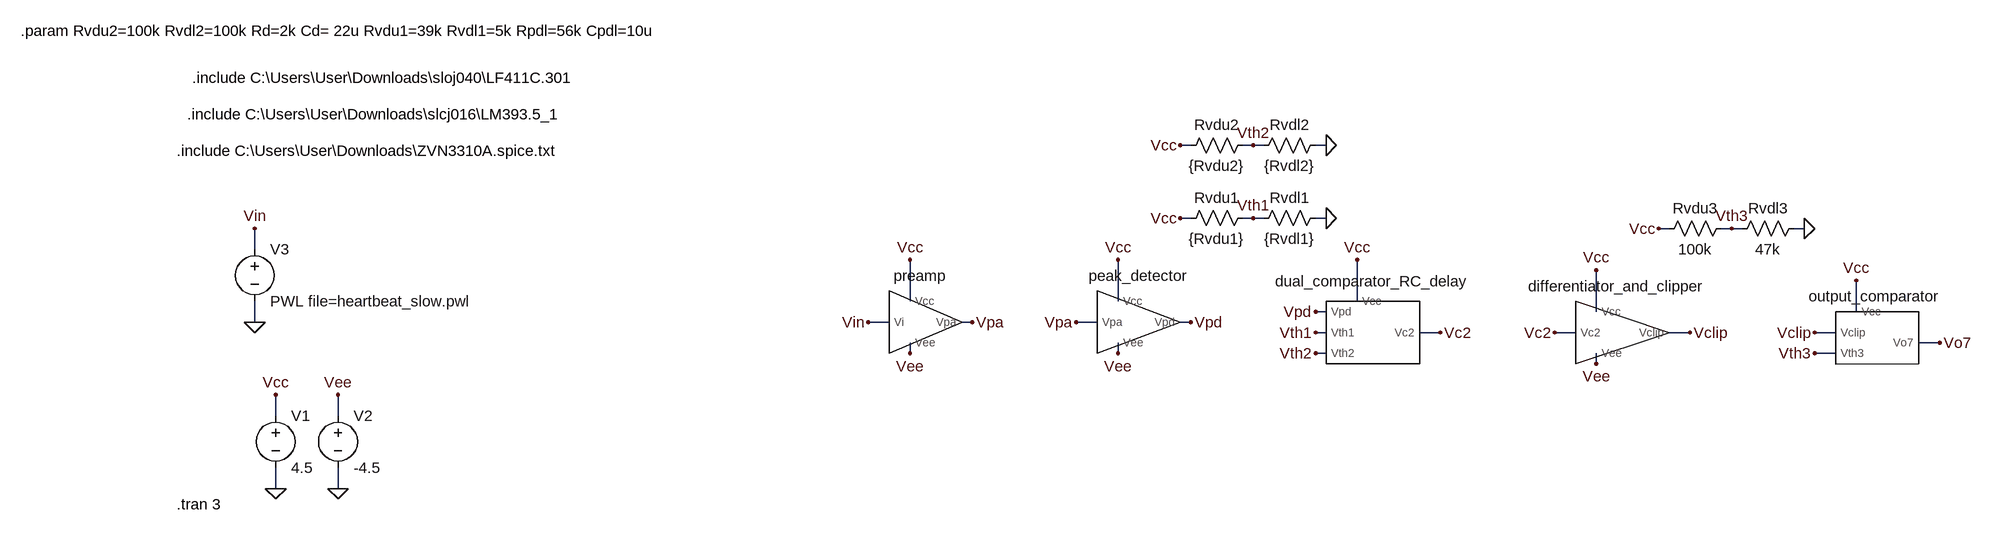
[diagram p0: schematic comparator_delay_demo.asc]
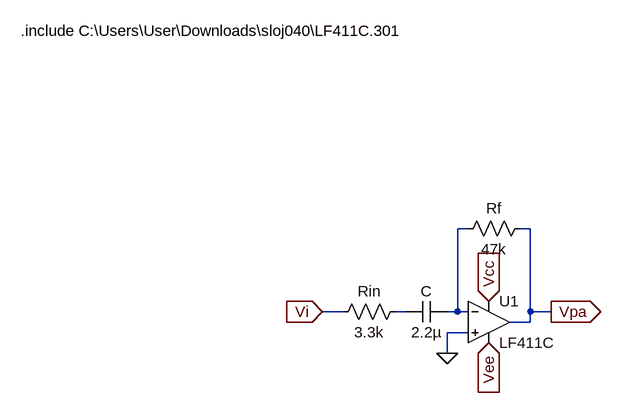
[diagram p1: sub-circuit preamp.asc]
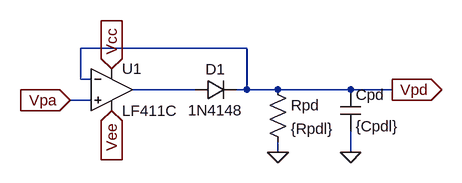
[diagram p2: sub-circuit peakdetector_lab7.asc]
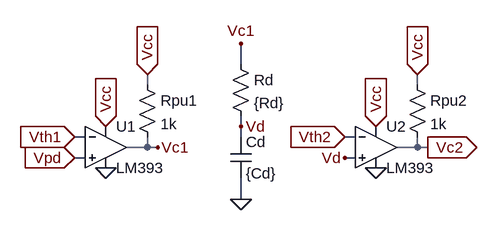
[diagram p3: sub-circuit delay.asc]
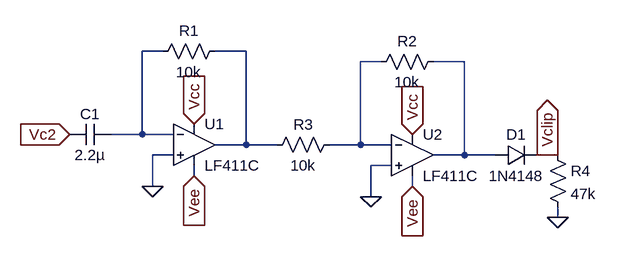
[diagram p4: sub-circuit differentiator_clipper.asc]
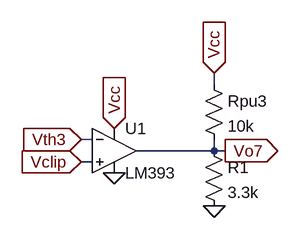
[diagram p5: sub-circuit outputcomparator.asc]
comparator_delay_demo.asc, the LTspice schematic file:
Version 4
SHEET 1 3844 680
WIRE 1344 -368 1328 -368
WIRE 1440 -368 1424 -368
WIRE 1456 -368 1440 -368
WIRE 1552 -368 1536 -368
WIRE 1344 -256 1328 -256
WIRE 1440 -256 1424 -256
WIRE 1456 -256 1440 -256
WIRE 1552 -256 1536 -256
WIRE 2080 -240 2064 -240
WIRE 2176 -240 2160 -240
WIRE 2192 -240 2176 -240
WIRE 2288 -240 2272 -240
WIRE -96 -208 -96 -240
WIRE 912 -128 912 -192
WIRE 1232 -128 1232 -192
WIRE 1600 -128 1600 -192
WIRE 1552 -112 1536 -112
WIRE 1968 -112 1968 -176
WIRE 2368 -112 2368 -160
WIRE -96 -96 -96 -128
WIRE 880 -96 848 -96
WIRE 1008 -96 992 -96
WIRE 1200 -96 1168 -96
WIRE 1344 -96 1328 -96
WIRE 1552 -80 1536 -80
WIRE 1728 -80 1696 -80
WIRE 1936 -80 1904 -80
WIRE 2112 -80 2080 -80
WIRE 2336 -80 2304 -80
WIRE 2496 -64 2464 -64
WIRE 912 -48 912 -64
WIRE 1232 -48 1232 -64
WIRE 1552 -48 1536 -48
WIRE 2336 -48 2304 -48
WIRE 1968 -32 1968 -48
WIRE -64 48 -64 16
WIRE 32 48 32 16
WIRE -64 160 -64 128
WIRE 32 160 32 128
FLAG -64 160 0
FLAG 32 160 0
FLAG -64 16 Vcc
FLAG 32 16 Vee
FLAG -96 -96 0
FLAG -96 -240 Vin
FLAG 1552 -256 0
FLAG 1328 -256 Vcc
FLAG 1440 -256 Vth1
FLAG 1552 -368 0
FLAG 1328 -368 Vcc
FLAG 1440 -368 Vth2
FLAG 912 -48 Vee
FLAG 1008 -96 Vpa
FLAG 848 -96 Vin
FLAG 2288 -240 0
FLAG 2064 -240 Vcc
FLAG 2176 -240 Vth3
FLAG 1232 -48 Vee
FLAG 1168 -96 Vpa
FLAG 912 -192 Vcc
FLAG 1232 -192 Vcc
FLAG 1344 -96 Vpd
FLAG 1536 -112 Vpd
FLAG 1536 -80 Vth1
FLAG 1536 -48 Vth2
FLAG 1600 -192 Vcc
FLAG 1728 -80 Vc2
FLAG 1904 -80 Vc2
FLAG 1968 -176 Vcc
FLAG 1968 -32 Vee
FLAG 2112 -80 Vclip
FLAG 2304 -80 Vclip
FLAG 2304 -48 Vth3
FLAG 2368 -160 Vcc
FLAG 2496 -64 Vo7
SYMBOL voltage -64 32 R0
WINDOW 123 0 0 Left 0
WINDOW 39 0 0 Left 0
SYMATTR InstName V1
SYMATTR Value 4.5
SYMBOL voltage 32 32 R0
WINDOW 123 0 0 Left 0
WINDOW 39 0 0 Left 0
SYMATTR InstName V2
SYMATTR Value -4.5
SYMBOL voltage -96 -224 R0
WINDOW 123 0 0 Left 0
WINDOW 39 0 0 Left 0
SYMATTR InstName V3
SYMATTR Value PWL file=heartbeat_slow.pwl
SYMBOL res 1440 -240 R270
WINDOW 0 32 56 VTop 2
WINDOW 3 0 56 VBottom 2
SYMATTR InstName Rvdl1
SYMATTR Value {Rvdl1}
SYMBOL res 1328 -240 R270
WINDOW 0 32 56 VTop 2
WINDOW 3 0 56 VBottom 2
SYMATTR InstName Rvdu1
SYMATTR Value {Rvdu1}
SYMBOL res 1440 -352 R270
WINDOW 0 32 56 VTop 2
WINDOW 3 0 56 VBottom 2
SYMATTR InstName Rvdl2
SYMATTR Value {Rvdl2}
SYMBOL res 1328 -352 R270
WINDOW 0 32 56 VTop 2
WINDOW 3 0 56 VBottom 2
SYMATTR InstName Rvdu2
SYMATTR Value {Rvdu2}
SYMBOL preamp 928 -96 R0
SYMATTR InstName preamp
SYMBOL res 2176 -224 R270
WINDOW 0 32 56 VTop 2
WINDOW 3 0 56 VBottom 2
SYMATTR InstName Rvdl3
SYMATTR Value 47k
SYMBOL res 2064 -224 R270
WINDOW 0 32 56 VTop 2
WINDOW 3 0 56 VBottom 2
SYMATTR InstName Rvdu3
SYMATTR Value 100k
SYMBOL peakdetector_lab7 1264 -96 R0
SYMATTR InstName peak_detector
SYMBOL delay 1616 -96 R0
SYMATTR InstName dual_comparator_RC_delay
SYMBOL differentiator_clipper 2000 -80 R0
SYMATTR InstName differentiator_and_clipper
SYMBOL outputcomparator 2384 -64 R0
SYMATTR InstName output_comparator
TEXT -216 -360 Left 2 !.include C:\\Users\\User\\Downloads\\ZVN3310A.spice.txt
TEXT -200 -416 Left 2 !.include C:\\Users\\User\\Downloads\\slcj016\\LM393.5_1
TEXT -456 -544 Left 2 !.param Rvdu2=100k Rvdl2=100k Rd=2k Cd= 22u Rvdu1=39k Rvdl1=5k Rpdl=56k Cpdl=10u
TEXT -216 184 Left 2 !.tran 3
TEXT -192 -472 Left 2 !.include C:\\Users\\User\\Downloads\\sloj040\\LF411C.301

preamp.asc, the sub-circuit schematic file:
Version 4
SHEET 1 1208 680
WIRE 592 32 576 32
WIRE 688 32 672 32
WIRE 400 160 368 160
WIRE 496 160 480 160
WIRE 576 160 576 32
WIRE 576 160 560 160
WIRE 592 160 576 160
WIRE 688 160 688 32
WIRE 720 160 688 160
WIRE 688 176 688 160
WIRE 688 176 656 176
WIRE 592 192 560 192
WIRE 560 224 560 192
FLAG 560 224 0
FLAG 368 160 Vi
IOPIN 368 160 In
FLAG 624 144 Vcc
IOPIN 624 144 In
FLAG 624 208 Vee
IOPIN 624 208 In
FLAG 720 160 Vpa
IOPIN 720 160 Out
SYMBOL res 496 144 R90
WINDOW 0 0 56 VBottom 2
WINDOW 3 32 56 VTop 2
SYMATTR InstName Rin
SYMATTR Value 3.3k
SYMBOL cap 560 144 R90
WINDOW 0 0 32 VBottom 2
WINDOW 3 32 32 VTop 2
SYMATTR InstName C
SYMATTR Value 2.2µ
SYMBOL OpAmps\\opamp2 624 112 R0
SYMATTR InstName U1
SYMATTR Value LF411C
SYMBOL res 688 16 R90
WINDOW 0 0 56 VBottom 2
WINDOW 3 32 56 VTop 2
SYMATTR InstName Rf
SYMATTR Value 47k
TEXT -96 -272 Left 2 !.include C:\\Users\\User\\Downloads\\sloj040\\LF411C.301

peakdetector_lab7.asc, the sub-circuit schematic file:
Version 4
SHEET 1 880 680
WIRE 240 112 -16 112
WIRE -16 160 -16 112
WIRE 0 160 -16 160
WIRE 160 176 64 176
WIRE 240 176 240 112
WIRE 240 176 224 176
WIRE 288 176 240 176
WIRE 400 176 288 176
WIRE 464 176 400 176
WIRE 0 192 -32 192
WIRE 288 272 288 256
WIRE 400 272 400 240
FLAG -32 192 Vpa
IOPIN -32 192 In
FLAG 32 144 Vcc
IOPIN 32 144 In
FLAG 32 208 Vee
IOPIN 32 208 In
FLAG 464 176 Vpd
IOPIN 464 176 Out
FLAG 288 272 0
FLAG 400 272 0
SYMBOL diode 160 192 R270
WINDOW 0 32 32 VTop 2
WINDOW 3 0 32 VBottom 2
SYMATTR InstName D1
SYMATTR Value 1N4148
SYMBOL res 272 160 R0
SYMATTR InstName Rpd
SYMATTR Value {Rpdl}
SYMBOL cap 384 176 R0
SYMATTR InstName Cpd
SYMATTR Value {Cpdl}
SYMBOL OpAmps\\opamp2 32 112 R0
SYMATTR InstName U1
SYMATTR Value LF411C

delay.asc, the sub-circuit schematic file:
Version 4
SHEET 1 880 680
WIRE 192 96 192 64
WIRE 48 128 48 112
WIRE 464 128 464 112
WIRE 192 192 192 176
WIRE -48 208 -64 208
WIRE 192 208 192 192
WIRE 368 208 352 208
WIRE 48 224 48 208
WIRE 48 224 16 224
WIRE 64 224 48 224
WIRE 464 224 464 208
WIRE 464 224 432 224
WIRE 480 224 464 224
WIRE -48 240 -64 240
WIRE 368 240 352 240
WIRE 192 304 192 272
FLAG -16 256 0
FLAG -16 192 Vcc
IOPIN -16 192 In
FLAG -64 208 Vth1
IOPIN -64 208 In
FLAG -64 240 Vpd
IOPIN -64 240 In
FLAG 64 224 Vc1
FLAG 48 112 Vcc
IOPIN 48 112 In
FLAG 400 256 0
FLAG 400 192 Vcc
IOPIN 400 192 In
FLAG 352 240 Vd
FLAG 464 112 Vcc
IOPIN 464 112 In
FLAG 192 304 0
FLAG 192 64 Vc1
FLAG 192 192 Vd
FLAG 352 208 Vth2
IOPIN 352 208 In
FLAG 480 224 Vc2
IOPIN 480 224 Out
SYMBOL OpAmps\\opamp2 -16 160 R0
SYMATTR InstName U1
SYMATTR Value LM393
SYMBOL res 32 112 R0
SYMATTR InstName Rpu1
SYMATTR Value 1k
SYMBOL OpAmps\\opamp2 400 160 R0
SYMATTR InstName U2
SYMATTR Value LM393
SYMBOL res 448 112 R0
SYMATTR InstName Rpu2
SYMATTR Value 1k
SYMBOL res 176 80 R0
SYMATTR InstName Rd
SYMATTR Value {Rd}
SYMBOL cap 176 208 R0
SYMATTR InstName Cd
SYMATTR Value {Cd}

differentiator_clipper.asc, the sub-circuit schematic file:
Version 4
SHEET 1 880 680
WIRE -80 16 -112 16
WIRE 48 16 0 16
WIRE 256 32 224 32
WIRE 384 32 336 32
WIRE -112 144 -112 16
WIRE -112 144 -160 144
WIRE -64 144 -112 144
WIRE 48 160 48 16
WIRE 48 160 0 160
WIRE 96 160 48 160
WIRE 224 160 224 32
WIRE 224 160 176 160
WIRE 272 160 224 160
WIRE -64 176 -96 176
WIRE 384 176 384 32
WIRE 384 176 336 176
WIRE 432 176 384 176
WIRE 512 176 496 176
WIRE 528 176 512 176
WIRE 272 192 240 192
WIRE -32 208 -32 192
WIRE -96 224 -96 176
WIRE 304 224 304 208
WIRE 240 240 240 192
WIRE 528 272 528 256
FLAG -96 224 0
FLAG -224 144 Vc2
IOPIN -224 144 In
FLAG -32 128 Vcc
IOPIN -32 128 In
FLAG -32 208 Vee
IOPIN -32 208 In
FLAG 240 240 0
FLAG 304 144 Vcc
IOPIN 304 144 In
FLAG 304 224 Vee
IOPIN 304 224 In
FLAG 528 272 0
FLAG 512 176 Vclip
IOPIN 512 176 Out
SYMBOL OpAmps\\opamp2 -32 96 R0
SYMATTR InstName U1
SYMATTR Value LF411C
SYMBOL res 16 0 R90
WINDOW 0 0 56 VBottom 2
WINDOW 3 32 56 VTop 2
SYMATTR InstName R1
SYMATTR Value 10k
SYMBOL cap -160 128 R90
WINDOW 0 0 32 VBottom 2
WINDOW 3 32 32 VTop 2
SYMATTR InstName C1
SYMATTR Value 2.2µ
SYMBOL OpAmps\\opamp2 304 112 R0
SYMATTR InstName U2
SYMATTR Value LF411C
SYMBOL res 352 16 R90
WINDOW 0 0 56 VBottom 2
WINDOW 3 32 56 VTop 2
SYMATTR InstName R2
SYMATTR Value 10k
SYMBOL res 192 144 R90
WINDOW 0 0 56 VBottom 2
WINDOW 3 32 56 VTop 2
SYMATTR InstName R3
SYMATTR Value 10k
SYMBOL diode 432 192 R270
WINDOW 0 32 32 VTop 2
WINDOW 3 0 32 VBottom 2
SYMATTR InstName D1
SYMATTR Value 1N4148
SYMBOL res 512 160 R0
SYMATTR InstName R4
SYMATTR Value 47k

outputcomparator.asc, the sub-circuit schematic file:
Version 4
SHEET 1 880 680
WIRE 272 112 272 96
WIRE 96 192 80 192
WIRE 272 208 272 192
WIRE 272 208 160 208
WIRE 288 208 272 208
WIRE 96 224 80 224
FLAG 128 240 0
FLAG 128 176 Vcc
IOPIN 128 176 In
FLAG 272 96 Vcc
IOPIN 272 96 In
FLAG 80 192 Vth3
IOPIN 80 192 In
FLAG 288 208 Vo7
IOPIN 288 208 Out
FLAG 80 224 Vclip
IOPIN 80 224 In
FLAG 272 288 0
SYMBOL OpAmps\\opamp2 128 144 R0
SYMATTR InstName U1
SYMATTR Value LM393
SYMBOL res 256 96 R0
SYMATTR InstName Rpu3
SYMATTR Value 10k
SYMBOL res 256 192 R0
SYMATTR InstName R1
SYMATTR Value 3.3k

The netlist it stands for:
* comparator_delay_demo.asc
V1 Vcc 0 4.5
V2 Vee 0 -4.5
V3 Vin 0 PWL file=heartbeat_slow.pwl
Rvdl1 Vth1 0 {Rvdl1}
Rvdu1 Vcc Vth1 {Rvdu1}
Rvdl2 Vth2 0 {Rvdl2}
Rvdu2 Vcc Vth2 {Rvdu2}
Xpreamp Vcc Vee Vin Vpa preamp
Rvdl3 Vth3 0 47k
Rvdu3 Vcc Vth3 100k
Xpeak_detector Vcc Vee Vpa Vpd peakdetector_lab7
Xdual_comparator_RC_delay Vcc Vpd Vth1 Vth2 Vc2 delay
Xdifferentiator_and_clipper Vc2 Vcc Vee Vclip differentiator_clipper
Xoutput_comparator Vcc Vclip Vth3 Vo7 outputcomparator

* block symbol definitions
.subckt preamp Vcc Vee Vi Vpa
Rin N002 Vi 3.3k
C N001 N002 2.2µ
XU1 0 N001 Vcc Vee Vpa LF411C  ; pins In+ In- V+ V- OUT
Rf Vpa N001 47k
.include C:\Users\User\Downloads\sloj040\LF411C.301
.ends preamp

.subckt peakdetector_lab7 Vcc Vee Vpa Vpd
D1 N001 Vpd 1N4148
Rpd Vpd 0 {Rpdl}
Cpd Vpd 0 {Cpdl}
XU1 Vpa Vpd Vcc Vee N001 LF411C  ; pins In+ In- V+ V- OUT
.ends peakdetector_lab7

.subckt delay Vcc Vpd Vth1 Vth2 Vc2
XU1 Vpd Vth1 Vcc 0 Vc1 LM393  ; pins In+ In- V+ V- OUT
Rpu1 Vcc Vc1 1k
XU2 Vd Vth2 Vcc 0 Vc2 LM393  ; pins In+ In- V+ V- OUT
Rpu2 Vcc Vc2 1k
Rd Vc1 Vd {Rd}
Cd Vd 0 {Cd}
.ends delay

.subckt differentiator_clipper Vc2 Vcc Vee Vclip
XU1 0 N001 Vcc Vee N002 LF411C  ; pins In+ In- V+ V- OUT
R1 N002 N001 10k
C1 N001 Vc2 2.2µ
XU2 0 N003 Vcc Vee N004 LF411C  ; pins In+ In- V+ V- OUT
R2 N004 N003 10k
R3 N003 N002 10k
D1 N004 Vclip 1N4148
R4 Vclip 0 47k
.ends differentiator_clipper

.subckt outputcomparator Vcc Vclip Vth3 Vo7
XU1 Vclip Vth3 Vcc 0 Vo7 LM393  ; pins In+ In- V+ V- OUT
Rpu3 Vcc Vo7 10k
R1 Vo7 0 3.3k
.ends outputcomparator

.model D D
.lib standard.dio
.include C:\Users\User\Downloads\ZVN3310A.spice.txt
.include C:\Users\User\Downloads\slcj016\LM393.5_1
.param Rvdu2=100k Rvdl2=100k Rd=2k Cd= 22u Rvdu1=39k Rvdl1=5k Rpdl=56k Cpdl=10u
.tran 3
.include C:\Users\User\Downloads\sloj040\LF411C.301
.backanno
.end